# EAGLE schematic sensormodul (EAGLE 6.5.0)
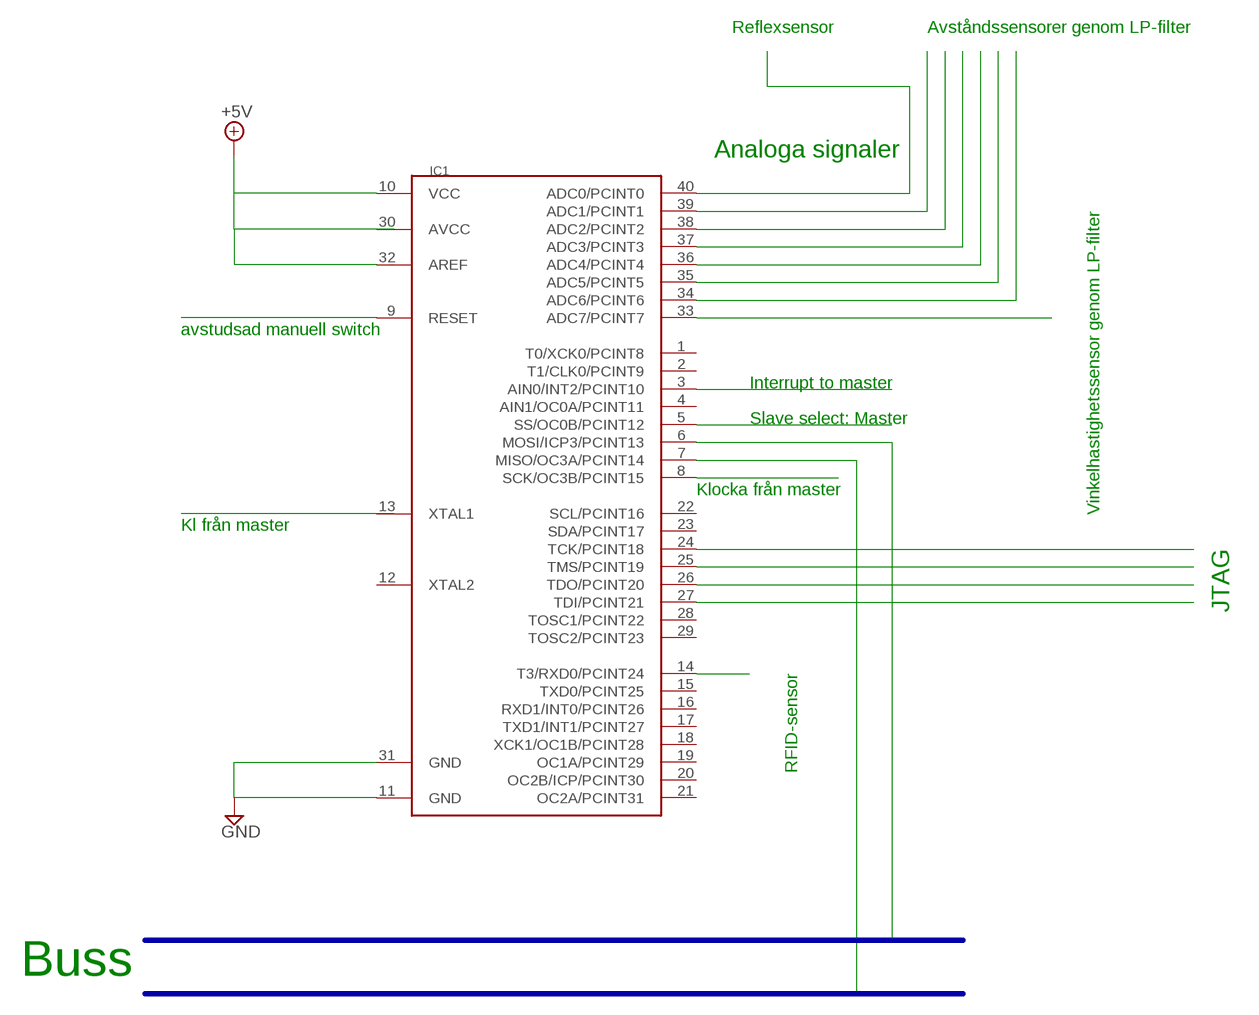
[diagram p0: schematic, sheet 1]

## Parts
IC1  MEGA1284P  [DIL40]

## Nets
+5V: IC1.10(VCC) IC1.32(AREF)
GND: IC1.11(GND) IC1.31(GND)
N$2: IC1.6(MOSI/ICP3/PCINT13)
N$3: IC1.7(MISO/OC3A/PCINT14)
N$4: IC1.39(ADC1/PCINT1)
N$5: IC1.38(ADC2/PCINT2)
N$6: IC1.37(ADC3/PCINT3)
N$7: IC1.36(ADC4/PCINT4)
N$8: IC1.35(ADC5/PCINT5)
N$10: IC1.14(T3/RXD0/PCINT24)
N$11: IC1.34(ADC6/PCINT6)
N$12: IC1.24(TCK/PCINT18)
N$13: IC1.5(SS/OC0B/PCINT12)
N$14: IC1.9(RESET)
N$16: IC1.3(AIN0/INT2/PCINT10)
N$17: IC1.8(SCK/OC3B/PCINT15)
N$18: IC1.25(TMS/PCINT19)
N$19: IC1.26(TDO/PCINT20)
N$20: IC1.27(TDI/PCINT21)
RE: IC1.40(ADC0/PCINT0)
Unconnected: IC1.1(T0/XCK0/PCINT8) IC1.2(T1/CLK0/PCINT9) IC1.4(AIN1/OC0A/PCINT11) IC1.12(XTAL2) IC1.13(XTAL1) IC1.15(TXD0/PCINT25) IC1.16(RXD1/INT0/PCINT26) IC1.17(TXD1/INT1/PCINT27) IC1.18(XCK1/OC1B/PCINT28) IC1.19(OC1A/PCINT29) IC1.20(OC2B/ICP/PCINT30) IC1.21(OC2A/PCINT31) IC1.22(SCL/PCINT16) IC1.23(SDA/PCINT17) IC1.28(TOSC1/PCINT22) IC1.29(TOSC2/PCINT23) IC1.30(AVCC) IC1.33(ADC7/PCINT7)

## Buses
B$1
B$2

## Notes on the sheet
- Reflexsensor | Avståndssensorer genom LP-filter
- Analoga signaler
- Vinkelhastighetssensor genom LP-filter
- avstudsad manuell switch
- Interrupt to master
- Slave select: Master
- Klocka från master
- Kl från master
- JTAG
- RFID-sensor
- Buss

## Library data of the parts
IC1 = 1284p:MEGA1284P: Atmel ATmega1284P 8-bit AVR Microcontroller